# EAGLE design blinker-with-leds (EAGLE 9.3.2)
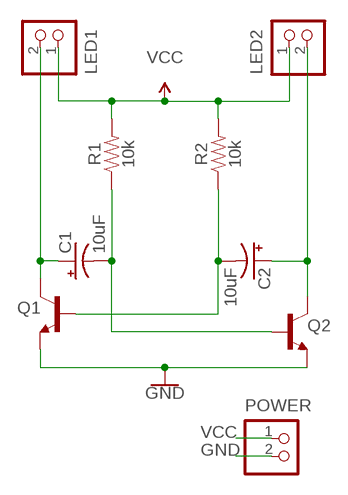
[diagram p0: schematic, sheet 1]

## Parts
C1  10uF  10UF-POLAR-RADIAL-2.5MM-25V-20%  [CPOL-RADIAL-2.5MM-5MM]
C2  10uF  10UF-POLAR-RADIAL-2.5MM-25V-20%  [CPOL-RADIAL-2.5MM-5MM]
LED1  B2B-XH-A  [B2B-XH-A]
LED2  B2B-XH-A  [B2B-XH-A]
POWER  B2B-XH-A  [B2B-XH-A]
Q1  600mA/40V  TRANS_NPN-P2N2222A  [TO-92]
Q2  600mA/40V  TRANS_NPN-P2N2222A  [TO-92]
R1  10k  10KOHM-HORIZ-1/4W-1%  [AXIAL-0.3]
R2  10k  10KOHM-HORIZ-1/4W-1%  [AXIAL-0.3]

## Nets
GND: POWER.2 Q1.3(E) Q2.3(E)
LED1-GND: C1.1(+) LED1.2 Q1.1(C)
LED2-GND: C2.1(+) LED2.2 Q2.1(C)
Q1-BASE: C2.2(-) Q1.2(B) R2.P$1
Q2-BASE: C1.2(-) Q2.2(B) R1.P$1
VCC: LED1.1 LED2.1 POWER.1 R1.P$2 R2.P$2

## Library data of the parts
C1 C2 = SparkFun-Capacitors:10UF-POLAR: 10.0µF polarized capacitors A capacitor is a passive two-terminal electrical component used to store electrical energy temporarily in an electric field.; PROD_ID: CAP-08440
LED1 LED2 POWER = jst-xh:B2B-XH-A: Wire-to-Board 2.5mm pitch top mount connector Source: http://www.jst-mfg.com/product/pdf/jpn/XH.pdf http://www.jst-mfg.com/product/detail.php?series=277
Q1 Q2 = SparkFun-DiscreteSemi:TRANS_NPN: NPN transistor Current controlled devices typically used to amplify current or used as a switch. BC547 - COM-08928 <http://www.sparkfun.com/products/8928> (TO-92 45V 100mA) (1.Collector 2.Base 3.Emitter) 2N3904 - COM-00521 <http://www.sparkfun.com/products/521> (TO-92 40V 200mA) (1.Emitter 2.Base 3.Collector) P2N2222A - COM-12852 <http://www.sparkfun.com/products/12852> (TO-92 40V 600mA) (1.Collector 2.Base 3.Emitter); PROD_ID: TRANS-09536
R1 R2 = SparkFun-Resistors:10KOHM: 10kΩ resistor A resistor is a passive two-terminal electrical component that implements electrical resistance as a circuit element. Resistors act to reduce current flow, and, at the same time, act to lower voltage levels within circuits. - Wikipedia; PROD_ID: RES-12183

## Board
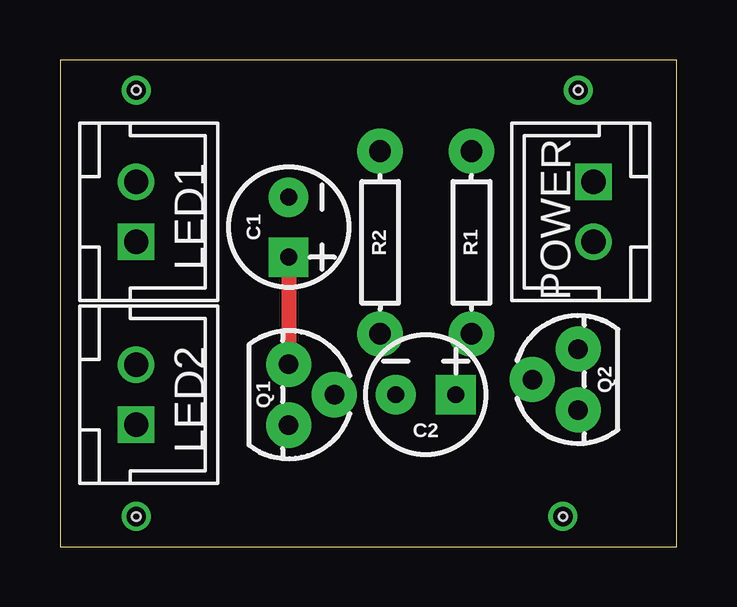
[diagram p1: board, top side]
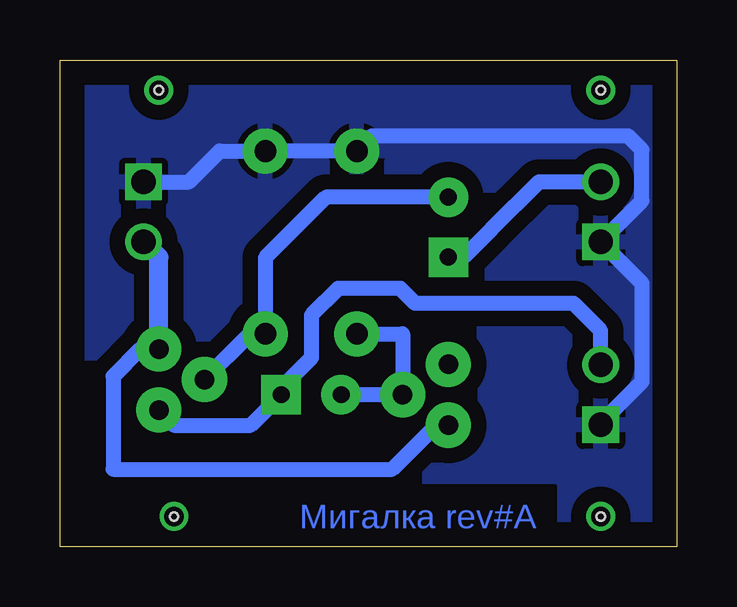
[diagram p2: board, bottom side, seen from below]

Size 25.7 x 20.31 mm. Coordinates in mm from the lower left corner, seen from the top.
Outline: 0,0 25.7,0 25.7,20.31 0,20.31 0,0
Copper layers (1*16): Top 0.035mm / dielectric 1.5mm / Bottom 0.035mm
Design rules "default *": minimum track width 6mil, minimum drill 0.35mm, track to track 25mil, track to pad 25mil, pad to pad 6mil, via to via 6mil, smd to smd 6mil, copper to edge 40mil, drill to drill 6mil, minimum pad ring 10mil, minimum via ring 8mil, stop-mask expansion 4mil, vias tented up to drill 0mil, thermal gap 10mil
Holes 0.35 mm at 3.17,1.27 3.17,19.05 20.95,1.27 21.59,19.05

### Footprints (pad centres in the part's own frame; a part is rotated, then mirrored left to right if it is on the bottom)
CPOL-RADIAL-2.5MM-5MM = drill 0.7 pad 1.651 square: 1 1.25,0 | drill 0.7 pad 1.651: 2 -1.25,0
B2B-XH-A = drill 1.016 square: 1 -1.25,0 | drill 1.016: 2 1.25,0
TO-92 = drill 0.813 pad 1.88: 1 -1.27,0; 2 0,1.905; 3 1.27,0
AXIAL-0.3 = drill 0.9 pad 1.88: P$1 -3.81,0; P$2 3.81,0

### Placement (x,y rotation side)
C1  9.53,13.34 270 top
C2  15.24,6.35 0 top
LED1  3.17,13.97 90 top
LED2  3.17,6.35 90 top
POWER  22.23,13.97 270 top
Q1  9.53,6.35 270 top
Q2  21.59,6.99 90 top
R1  17.14,12.7 90 top
R2  13.34,12.7 90 top

### Tracks (layer width: path | path; a pad name or v marks a point on that pad's centre or on a via)
GND
  Bottom 0.635: Q1.3 10.02,5.08 11.87,3.24 23.5,3.24 23.5,7.12 22.37,8.24 21.6,8.24 Q2.3
  Bottom 0.8: Q2.3 21.59,12.09 POWER.2
LED1-GND
  Top 0.635: C1.1 Q1.1
  Bottom 0.635: LED1.2 5.75,15.22 7.75,13.23 7.75,13.21 8.79,12.17 9.44,12.17 C1.1
LED2-GND
  Bottom 0.635: Q2.1 20.95,5.08 17.76,5.08 C2.1 16.63,6.49 15.23,7.88 15.23,9.67 14.12,10.78 11.53,10.78 10.9,10.16 4.31,10.16 3.17,9.03 LED2.2
N$1  (via drill 0.8)
  other vias: 3.17,1.27
N$2  (via drill 0.8)
  other vias: 3.17,19.05
N$3  (via drill 0.8)
  other vias: 21.59,19.05
N$4  (via drill 0.8)
  other vias: 20.95,1.27
N$5
  cutout Bottom: 5.08,2.54 5.08,0 16.51,0 16.51,2.54
Q1-BASE
  Bottom 0.635: C2.2 Q1.2 11.43,8.89 R2.P$1
Q2-BASE
  Bottom 0.635: C1.2 14.62,14.59 17.14,12.06 17.14,9.53 Q2.2 17.78,8.89 R1.P$1
VCC
  Bottom 0.635: POWER.1 20.34,15.22 19.05,16.51 R1.P$2 R2.P$2 12.7,17.14 2.04,17.14 1.46,16.57 1.46,14.43 LED1.1 1.46,11.01 1.46,6.89 3.02,5.33 3.02,5.1 LED2.1
  pour Bottom: 0,20.32 0,0 25.4,0 25.4,20.32

### Text on the board
Bottom: Мигалка rev#A